# EAGLE design led_final (EAGLE 9.6.0)
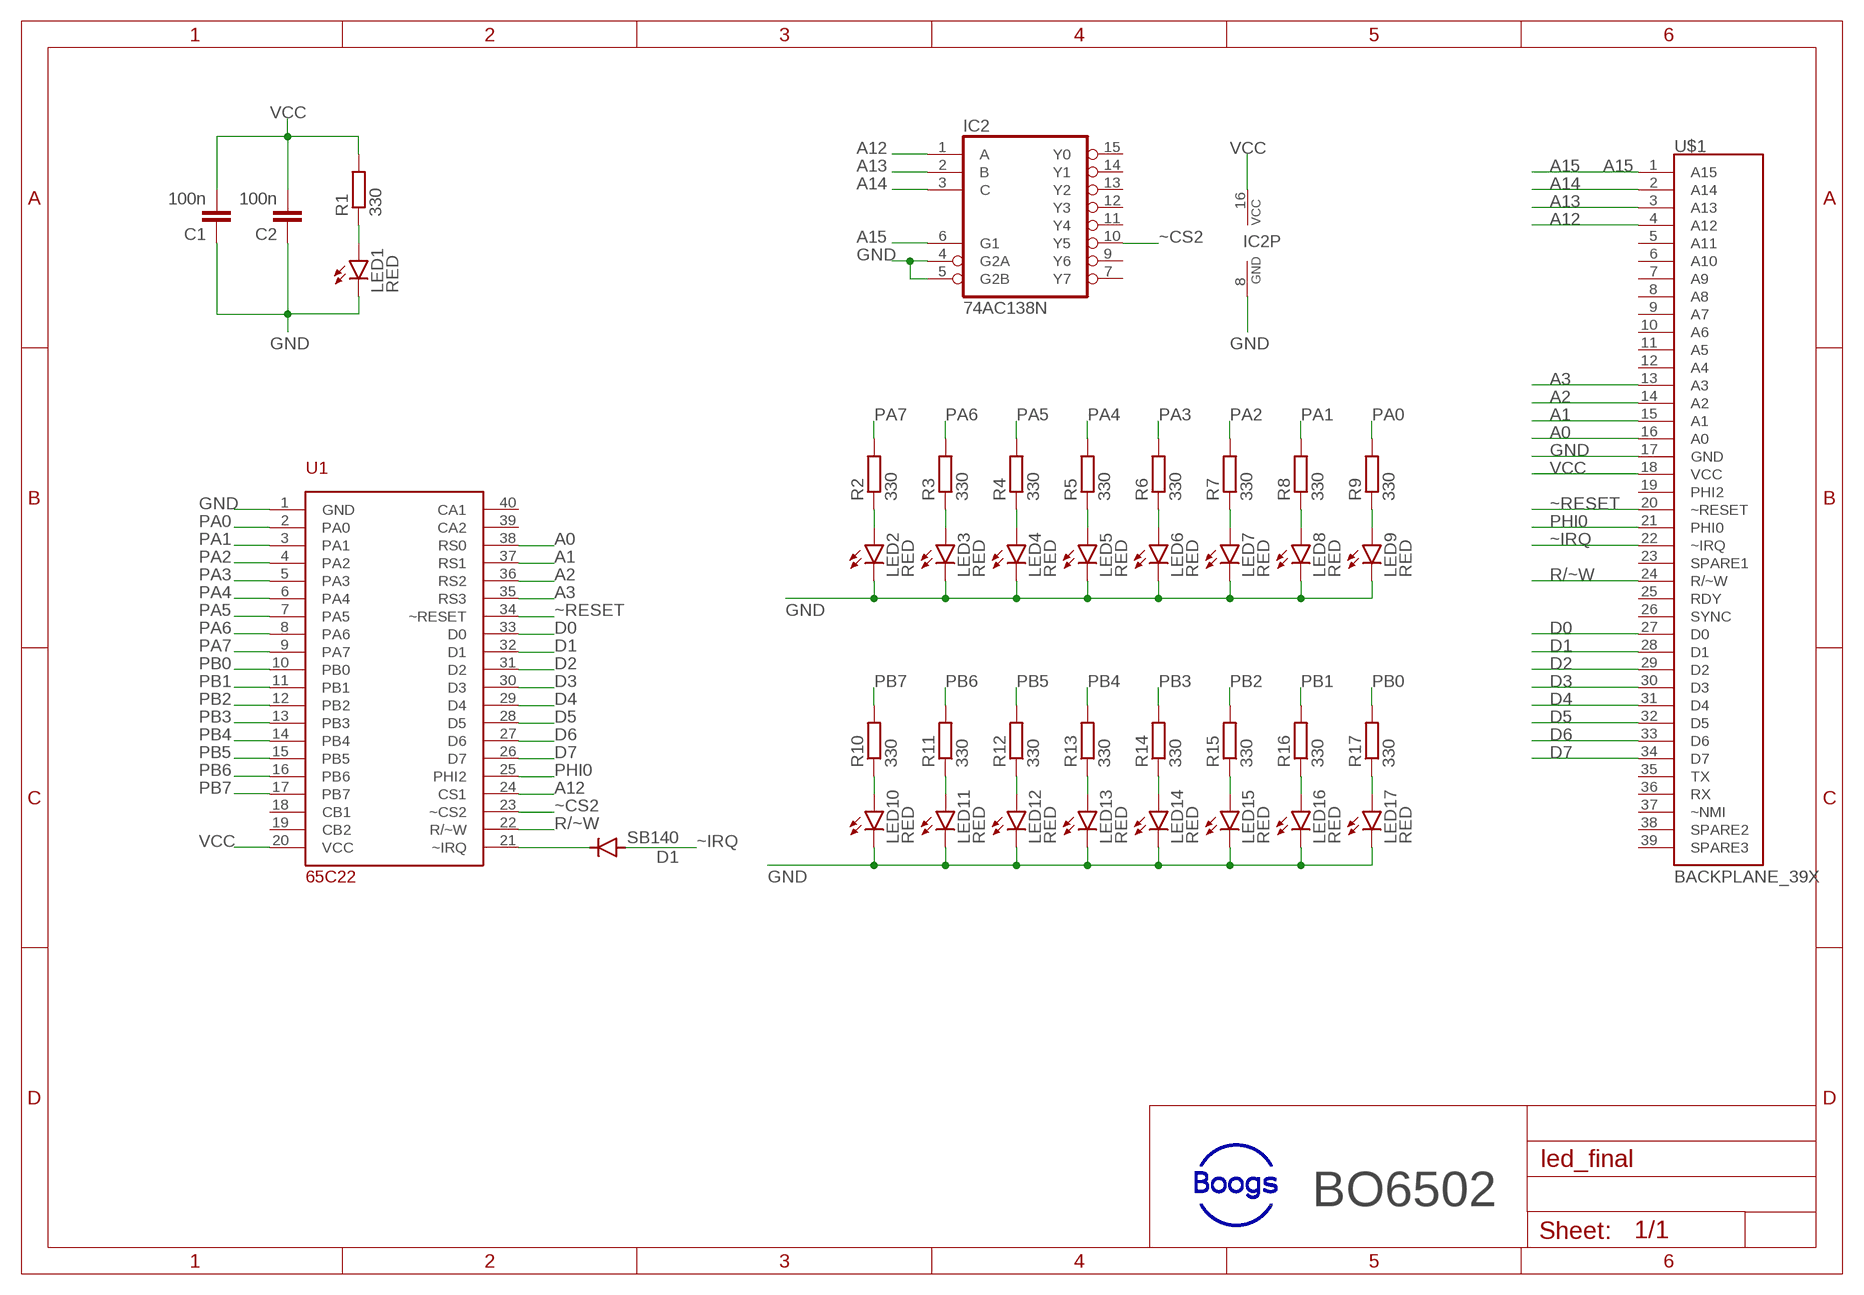
[diagram p0: schematic, sheet 1]

## Parts
C1  100n  C-EU025-025X050  [C025-025X050]
C2  100n  C-EU025-025X050  [C025-025X050]
D1  SB140  1N4004  [DO41-10]
IC2  74AC138N  [DIL16]
LED1  RED  LED5MM  [LED5MM]
LED2  RED  LED5MM  [LED5MM]
LED3  RED  LED5MM  [LED5MM]
LED4  RED  LED5MM  [LED5MM]
LED5  RED  LED5MM  [LED5MM]
LED6  RED  LED5MM  [LED5MM]
LED7  RED  LED5MM  [LED5MM]
LED8  RED  LED5MM  [LED5MM]
LED9  RED  LED5MM  [LED5MM]
LED10  RED  LED5MM  [LED5MM]
LED11  RED  LED5MM  [LED5MM]
LED12  RED  LED5MM  [LED5MM]
LED13  RED  LED5MM  [LED5MM]
LED14  RED  LED5MM  [LED5MM]
LED15  RED  LED5MM  [LED5MM]
LED16  RED  LED5MM  [LED5MM]
LED17  RED  LED5MM  [LED5MM]
R1  330  R-EU_0207/10  [0207/10]
R2  330  R-EU_0207/10  [0207/10]
R3  330  R-EU_0207/10  [0207/10]
R4  330  R-EU_0207/10  [0207/10]
R5  330  R-EU_0207/10  [0207/10]
R6  330  R-EU_0207/10  [0207/10]
R7  330  R-EU_0207/10  [0207/10]
R8  330  R-EU_0207/10  [0207/10]
R9  330  R-EU_0207/10  [0207/10]
R10  330  R-EU_0207/10  [0207/10]
R11  330  R-EU_0207/10  [0207/10]
R12  330  R-EU_0207/10  [0207/10]
R13  330  R-EU_0207/10  [0207/10]
R14  330  R-EU_0207/10  [0207/10]
R15  330  R-EU_0207/10  [0207/10]
R16  330  R-EU_0207/10  [0207/10]
R17  330  R-EU_0207/10  [0207/10]
U1  65C22  [DIL40]
U$1  BACKPLANE_39X  [BP_39X]

## Nets
A0: U1.38(RS0) U$1.16(A0)
A1: U1.37(RS1) U$1.15(A1)
A2: U1.36(RS2) U$1.14(A2)
A3: U1.35(RS3) U$1.13(A3)
A12: IC2.1(A) U1.24(CS1) U$1.4(A12)
A13: IC2.2(B) U$1.3(A13)
A14: IC2.3(C) U$1.2(A14)
A15: IC2.6(G1) U$1.1(A15)
D0: U1.33(D0) U$1.27(D0)
D1: U1.32(D1) U$1.28(D1)
D2: U1.31(D2) U$1.29(D2)
D3: U1.30(D3) U$1.30(D3)
D4: U1.29(D4) U$1.31(D4)
D5: U1.28(D5) U$1.32(D5)
D6: U1.27(D6) U$1.33(D6)
D7: U1.26(D7) U$1.34(D7)
GND: C1.1 C2.1 IC2.4(G2A) IC2.5(G2B) IC2.8(GND) LED1.K(C) LED2.K(C) LED3.K(C) LED4.K(C) LED5.K(C) LED6.K(C) LED7.K(C) LED8.K(C) LED9.K(C) LED10.K(C) LED11.K(C) LED12.K(C) LED13.K(C) LED14.K(C) LED15.K(C) LED16.K(C) LED17.K(C) U1.1(GND) U$1.17(GND)
N$1: D1.C U1.21(~IRQ)
N$3: LED2.A R2.1
N$4: LED3.A R3.1
N$6: LED1.A R1.1
N$7: LED4.A R4.1
N$8: LED5.A R5.1
N$9: LED6.A R6.1
N$10: LED7.A R7.1
N$11: LED8.A R8.1
N$12: LED9.A R9.1
N$13: LED10.A R10.1
N$14: LED11.A R11.1
N$15: LED12.A R12.1
N$16: LED13.A R13.1
N$17: LED14.A R14.1
N$18: LED15.A R15.1
N$19: LED16.A R16.1
N$20: LED17.A R17.1
PA0: R9.2 U1.2(PA0)
PA1: R8.2 U1.3(PA1)
PA2: R7.2 U1.4(PA2)
PA3: R6.2 U1.5(PA3)
PA4: R5.2 U1.6(PA4)
PA5: R4.2 U1.7(PA5)
PA6: R3.2 U1.8(PA6)
PA7: R2.2 U1.9(PA7)
PB0: R17.2 U1.10(PB0)
PB1: R16.2 U1.11(PB1)
PB2: R15.2 U1.12(PB2)
PB3: R14.2 U1.13(PB3)
PB4: R13.2 U1.14(PB4)
PB5: R12.2 U1.15(PB5)
PB6: R11.2 U1.16(PB6)
PB7: R10.2 U1.17(PB7)
PHI0: U1.25(PHI2) U$1.21(PHI0)
R/~W: U1.22(R/~W) U$1.24(R/~W)
VCC: C1.2 C2.2 IC2.16(VCC) R1.2 U1.20(VCC) U$1.18(VCC)
~CS2: IC2.10(Y5) U1.23(~CS2)
~IRQ: D1.A U$1.22(~IRQ)
~RESET: U1.34(~RESET) U$1.20(~RESET)
Unconnected: IC2.7(Y7) IC2.9(Y6) IC2.11(Y4) IC2.12(Y3) IC2.13(Y2) IC2.14(Y1) IC2.15(Y0) U1.18(CB1) U1.19(CB2) U1.39(CA2) U1.40(CA1) U$1.5(A11) U$1.6(A10) U$1.7(A9) U$1.8(A8) U$1.9(A7) U$1.10(A6) U$1.11(A5) U$1.12(A4) U$1.19(PHI2) U$1.23(SPARE1) U$1.25(RDY) U$1.26(SYNC) U$1.35(TX) U$1.36(RX) U$1.37(~NMI) U$1.38(SPARE2) U$1.39(SPARE3)

## Notes on the sheet
- BO6502

## Library data of the parts
C1 C2 = rcl:C-EU: CAPACITOR, European symbol; SPICEPREFIX: C
D1 = diode:1N4004: DIODE general purpose rectifier, 1 A
IC2 = 74xx-eu:74*138: 3-line to 8-line DECODER/DEMULTIPLEXER
LED1-LED17 = led:LED: LED OSRAM: - CHIPLED LG R971, LG N971, LY N971, LG Q971, LY Q971, LO R971, LY R971 LH N974, LH R974 LS Q976, LO Q976, LY Q976 LO Q996 - Hyper CHIPLED LW Q18S LB Q993, LB Q99A, LB R99A - SideLED LS A670, LO A670, LY A670, LG A670, LP A670 LB A673, LV A673, LT A673, LW A673 LH A674 LY A675 LS A676, LA A676, LO A676, LY A676, LW A676 LS A679, LY A679, LG A679 - Hyper Micro SIDELED® LS Y876, LA Y876, LO Y876, LY Y876 LT Y87S - SmartLED LW L88C, LW L88S LB L89C, LB L89S, LG L890 LS L89K, LO L89K, LY L89K LS L896, LA L896, LO L896, LY L896 - TOPLED LS T670, LO T670, LY T670, LG T670, LP T670 LSG T670, LSP T670, LSY T670, LOP T670, LYG T670 LG T671, LOG T671, LSG T671 LB T673, LV T673, LT T673, LW T673 LH T674 LS T676, LA T676, LO T676, LY T676, LB T676, LH T676, LSB T676, LW T676 LB T67C, LV T67C, LT T67C, LS T67K, LO T67K, LY T67K, LW E67C LS E67B, LA E67B, LO E67B, LY E67B, LB E67C, LV E67C, LT E67C LW T67C LS T679, LY T679, LG T679 LS T770, LO T770, LY T770, LG T770, LP T770 LB T773, LV T773, LT T773, LW T773 LH T774 LS E675, LA E675, LY E675, LS T675 LS T776, LA T776, LO T776, LY T776, LB T776 LHGB T686 LT T68C, LB T68C - Hyper Mini TOPLED® LB M676 - Mini TOPLED Santana® LG M470 LS M47K, LO M47K, LY M47K Source: http://www.osram.convergy.de LUXEON: - LUMILED® LXK2-PW12-R00, LXK2-PW12-S00, LXK2-PW14-U00, LXK2-PW14-V00 LXK2-PM12-R00, LXK2-PM12-S00, LXK2-PM14-U00 LXK2-PE12-Q00, LXK2-PE12-R00, LXK2-PE12-S00, LXK2-PE14-T00, LXK2-PE14-U00 LXK2-PB12-K00, LXK2-PB12-L00, LXK2-PB12-M00, LXK2-PB14-N00, LXK2-PB14-P00, LXK2-PB14-Q00 LXK2-PR12-L00, LXK2-PR12-M00, LXK2-PR14-Q00, LXK2-PR14-R00 LXK2-PD12-Q00, LXK2-PD12-R00, LXK2-PD12-S00 LXK2-PH12-R00, LXK2-PH12-S00 LXK2-PL12-P00, LXK2-PL12-Q00, LXK2-PL12-R00 Source: www.luxeon.com KINGBRIGHT: KA-3528ASYC Source: www.kingbright.com
R1-R17 = rcl:R-EU_: RESISTOR, European symbol; SPICEPREFIX: R
U1 = 65xx_family:65C22
U$1 = 65xx_family:BACKPLANE_39X; A15: A15

## Board
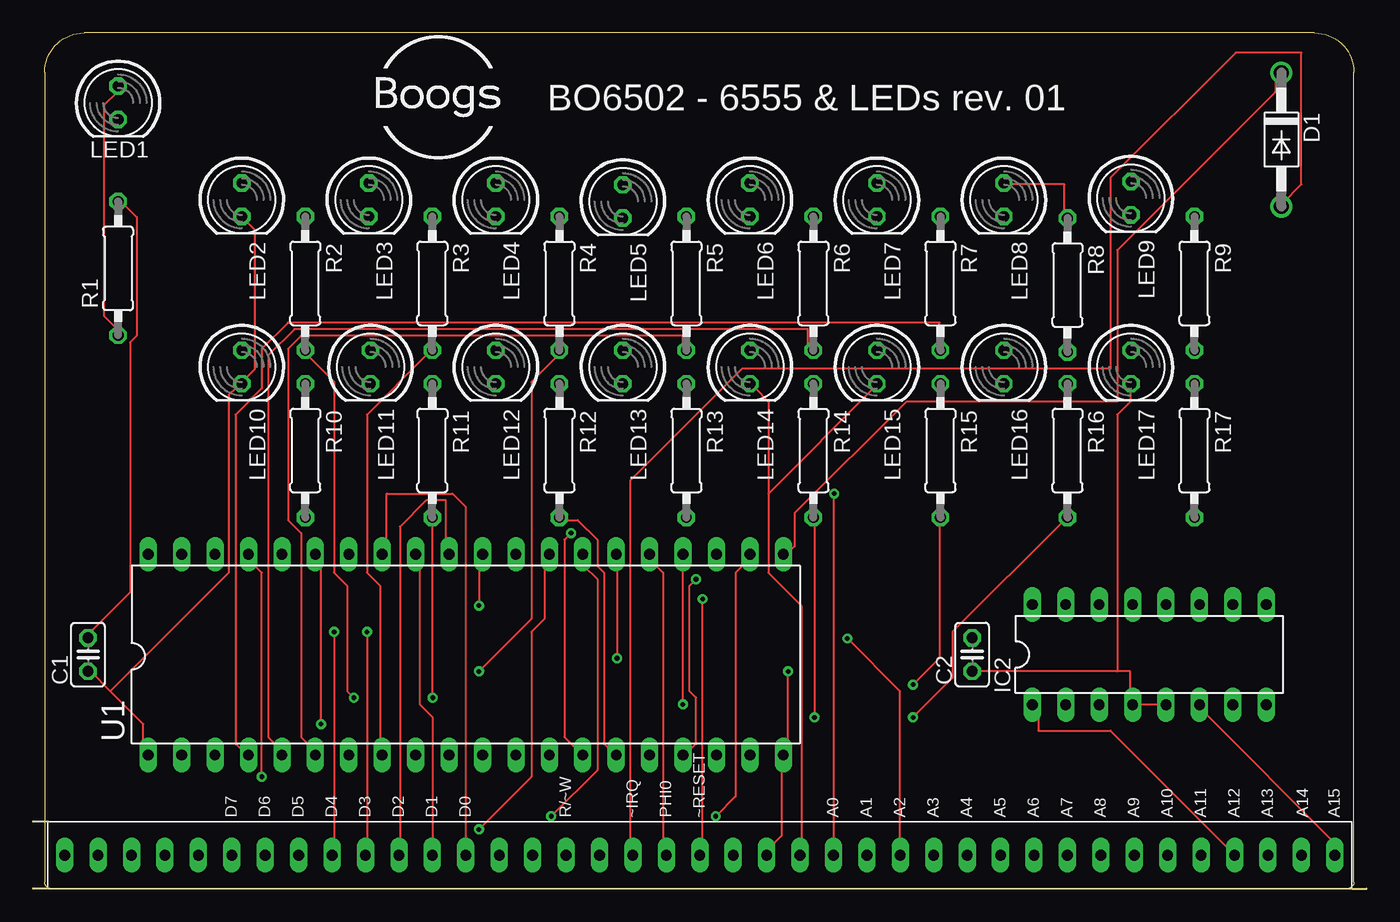
[diagram p1: board, top side]
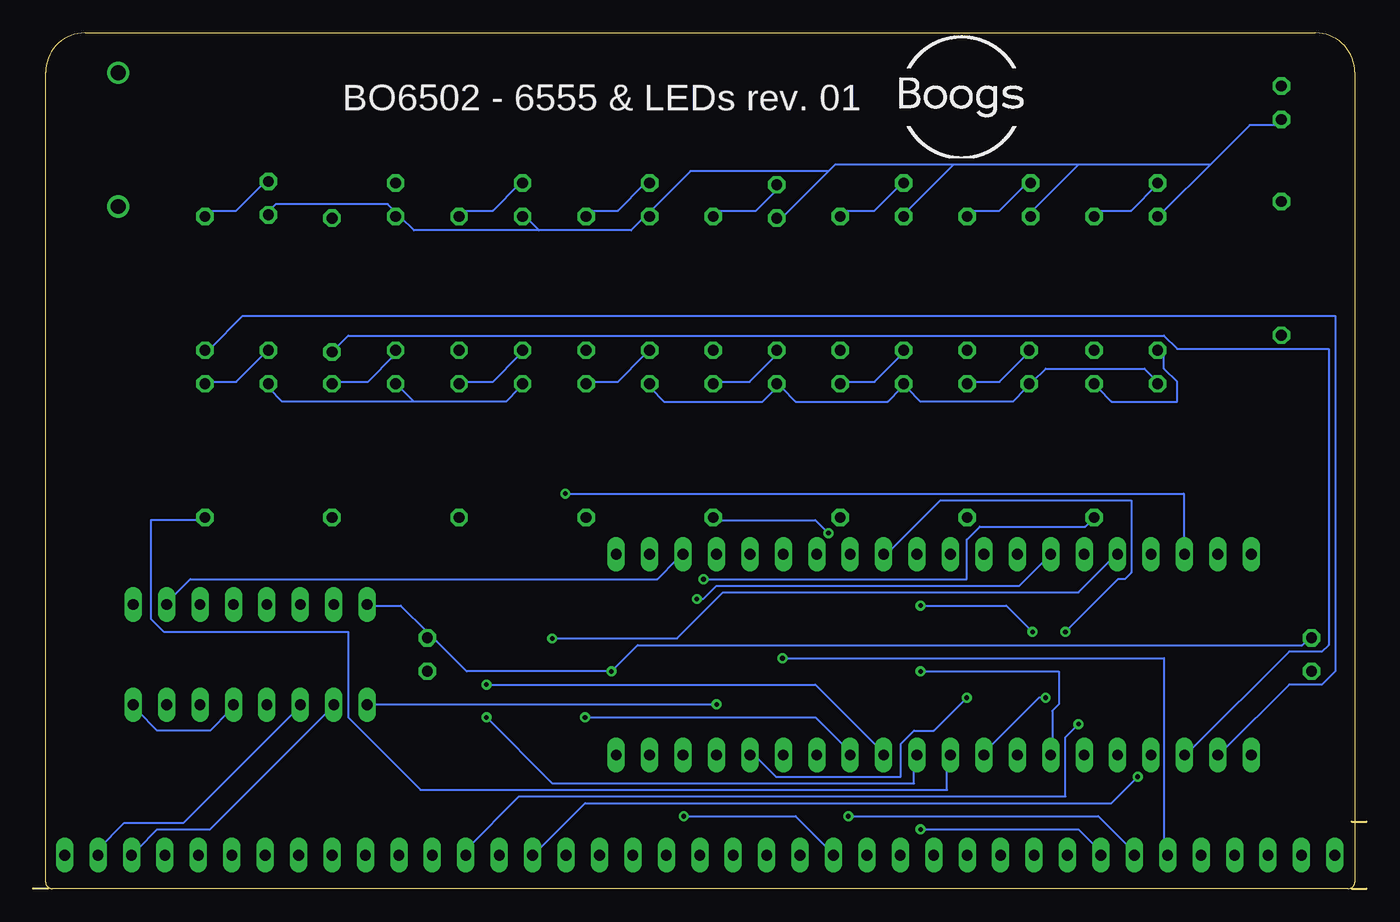
[diagram p2: board, bottom side, seen from below]

Size 101.35 x 65 mm. Coordinates in mm from the lower left corner, seen from the top.
Outline: 1.14,5.08 0,5.08
Outline: 1.14,0 0,0
Outline: 100.2,0 101.35,0
Outline: 1.39,0 99.89,0 arc90 100.39,0.5 100.39,62 arc90 97.39,65 3.89,65 arc90 0.89,62 0.89,0.5 arc90 1.39,0
Copper layers (1*16): Top 0.035mm / dielectric 1.5mm / Bottom 0.035mm
Design rules "default *": minimum track width 6mil, minimum drill 0.35mm, track to track 10mil, track to pad 10mil, pad to pad 10mil, via to via 10mil, smd to smd 6mil, copper to edge 40mil, drill to drill 6mil, minimum pad ring 10mil, minimum via ring 8mil, stop-mask expansion 4mil, vias tented up to drill 15mil, thermal gap 10mil

### Footprints (pad centres in the part's own frame; a part is rotated, then mirrored left to right if it is on the bottom)
C025-025X050 = drill 0.813 octagon: 1 -1.27,0; 2 1.27,0
DO41-10 = drill 1.118: A 5.08,0; C -5.08,0
DIL16 = drill 0.813 long: 1 -8.89,-3.81; 2 -6.35,-3.81; 3 -3.81,-3.81; 4 -1.27,-3.81; 5 1.27,-3.81; 6 3.81,-3.81; 7 6.35,-3.81; 8 8.89,-3.81; 9 8.89,3.81; 10 6.35,3.81; 11 3.81,3.81; 12 1.27,3.81; 13 -1.27,3.81; 14 -3.81,3.81; 15 -6.35,3.81; 16 -8.89,3.81
LED5MM = drill 0.813 octagon: A -1.27,0; K 1.27,0
0207/10 = drill 0.813 octagon: 1 -5.08,0; 2 5.08,0
DIL40 = drill 0.813 long: 1 -24.13,-7.62; 2 -21.59,-7.62; 3 -19.05,-7.62; 4 -16.51,-7.62; 5 -13.97,-7.62; 6 -11.43,-7.62; 7 -8.89,-7.62; 8 -6.35,-7.62; 9 -3.81,-7.62; 10 -1.27,-7.62; 11 1.27,-7.62; 12 3.81,-7.62; 13 6.35,-7.62; 14 8.89,-7.62; 15 11.43,-7.62; 16 13.97,-7.62; 17 16.51,-7.62; 18 19.05,-7.62; 19 21.59,-7.62; 20 24.13,-7.62; 21 24.13,7.62; 22 21.59,7.62; 23 19.05,7.62; 24 16.51,7.62; 25 13.97,7.62; 26 11.43,7.62; 27 8.89,7.62; 28 6.35,7.62; 29 3.81,7.62; 30 1.27,7.62; 31 -1.27,7.62; 32 -3.81,7.62; 33 -6.35,7.62; 34 -8.89,7.62; 35 -11.43,7.62; 36 -13.97,7.62; 37 -16.51,7.62; 38 -19.05,7.62; 39 -21.59,7.62; 40 -24.13,7.62
BP_39X = drill 0.813 long: 1 1.27,59.69; 2 1.27,57.15; 3 1.27,54.61; 4 1.27,52.07; 5 1.27,49.53; 6 1.27,46.99; 7 1.27,44.45; 8 1.27,41.91; 9 1.27,39.37; 10 1.27,36.83; 11 1.27,34.29; 12 1.27,31.75; 13 1.27,29.21; 14 1.27,26.67; 15 1.27,24.13; 16 1.27,21.59; 17 1.27,19.05; 18 1.27,16.51; 19 1.27,13.97; 20 1.27,11.43; 21 1.27,8.89; 22 1.27,6.35; 23 1.27,3.81; 24 1.27,1.27; 25 1.27,-1.27; 26 1.27,-3.81; 27 1.27,-6.35; 28 1.27,-8.89; 29 1.27,-11.43; 30 1.27,-13.97; 31 1.27,-16.51; 32 1.27,-19.05; 33 1.27,-21.59; 34 1.27,-24.13; 35 1.27,-26.67; 36 1.27,-29.21; 37 1.27,-31.75; 38 1.27,-34.29; 39 1.27,-36.83

### Placement (x,y rotation side)
C1  4.19,17.78 90 top
C2  71.37,17.78 90 top
D1  94.87,56.9 270 top
IC2  84.84,17.78 0 top
LED1  6.48,59.69 270 top
LED2  15.88,52.32 270 top
LED3  25.53,52.32 270 top
LED4  35.18,52.32 270 top
LED5  44.83,52.2 270 top
LED6  54.48,52.32 270 top
LED7  64.14,52.32 270 top
LED8  73.79,52.32 270 top
LED9  83.44,52.45 270 top
LED10  15.88,39.62 270 top
LED11  25.65,39.62 270 top
LED12  35.18,39.62 270 top
LED13  44.83,39.62 270 top
LED14  54.48,39.62 270 top
LED15  64.14,39.62 270 top
LED16  73.79,39.62 270 top
LED17  83.44,39.62 270 top
R1  6.48,47.12 90 top
R2  20.7,45.97 270 top
R3  30.35,45.97 270 top
R4  40.01,45.97 270 top
R5  49.66,45.97 270 top
R6  59.31,45.97 270 top
R7  68.96,45.97 270 top
R8  78.61,45.85 270 top
R9  88.27,45.97 270 top
R10  20.7,33.27 270 top
R11  30.35,33.27 270 top
R12  40.01,33.27 270 top
R13  49.66,33.27 270 top
R14  59.31,33.27 270 top
R15  68.96,33.27 270 top
R16  78.61,33.27 270 top
R17  88.27,33.27 270 top
U1  32.89,17.78 0 top
U$1  39.24,3.81 270 top

### Tracks (layer width: path | path; a pad name or v marks a point on that pad's centre or on a via)
A0  (via drill 0.35)
  Top 0.152: v60.89,30 60.89,3 U$1.16
  Bottom 0.152: v60.89,30 13.89,30 13.89,25.5 U1.38
A1  (via drill 0.35)
  Top 0.152: v17.39,8.5 17.39,24 16.39,25 U1.37
  Bottom 0.152: v17.39,8.5 19.39,6.5 59.39,6.5 62.89,3 U$1.15
A2  (via drill 0.35)
  Top 0.152: v61.89,19 65.89,15 65.89,3 U$1.14
  Bottom 0.152: v61.89,19 52.39,19 48.89,22.5 21.89,22.5 19.39,25 U1.36
A3  (via drill 0.35)
  Top 0.152: v21.89,12.5 21.89,25 U1.35
  Bottom 0.152: v21.89,12.5 22.89,11.5 22.89,7 64.39,7 68.39,3 U$1.13
A12  (via drill 0.35)
  Top 0.152: v49.39,14 49.39,25 U1.24 | U$1.4 90.89,3 81.89,12 76.39,12 76.39,13.5 IC2.1
  Bottom 0.152: v49.39,14 75.89,14 IC2.1
A13
  Bottom 0.152: IC2.2 78.89,13.5 87.89,4.5 91.89,4.5 93.39,3 U$1.3
A14
  Bottom 0.152: IC2.3 81.39,13.5 89.89,5 94.39,5 96.39,3 U$1.2
A15
  Top 0.152: IC2.6 88.89,13.5 98.89,3.5 98.89,3 U$1.1
D0
  Top 0.152: U$1.27 32.89,3 32.89,29 31.89,30 26.89,30 26.89,25.5 U1.33
D1
  Top 0.152: U$1.28 30.39,3 30.39,13 29.39,14 29.39,25 U1.32
D2
  Top 0.152: U$1.29 27.89,3 27.89,27.5 29.89,29.5 31.39,29.5 31.39,25.5 U1.31
D3  (via drill 0.35)
  Top 0.152: v25.39,19.5 25.39,3 U$1.30 | v33.89,21.5 33.89,25 U1.30
  Bottom 0.152: v25.39,19.5 27.39,21.5 v33.89,21.5
D4  (via drill 0.35)
  Top 0.152: v22.89,19.5 22.89,3 U$1.31
  Bottom 0.152: v22.89,19.5 18.89,23.5 18.39,23.5 17.89,24 17.89,29.5 32.39,29.5 36.39,25.5 U1.29
D5  (via drill 0.35)
  Top 0.152: v33.89,4.5 37.89,8.5 37.89,19.5 38.89,20.5 38.89,25 U1.28
  Bottom 0.152: v33.89,4.5 21.89,4.5 20.39,3 U$1.32
D6  (via drill 0.35)
  Top 0.152: v39.39,5.5 42.89,9 42.89,23.5 41.89,24.5 41.89,25 U1.27
  Bottom 0.152: v39.39,5.5 20.39,5.5 17.89,3 U$1.33
D7  (via drill 0.35)
  Top 0.152: v44.39,17.5 44.39,25 U1.26
  Bottom 0.152: v44.39,17.5 15.39,17.5 15.39,3 U$1.34
GND
  Top 0.152: 5.89,15 8.39,12.5 8.39,10.5 U1.1 | 5.89,15 4.39,16.5 C1.1 | 5.89,15 14.89,24 14.89,37.5 15.39,38 LED10.K 15.89,38.5 16.89,39.5 16.89,50 15.89,51 LED2.K | 82.39,16.5 83.39,16.5 83.39,14 IC2.4 83.89,14 85.89,14 IC2.5 | 82.39,16.5 71.39,16.5 C2.1 | 55.89,30 55.89,37 54.89,38 LED14.K | 55.89,30 55.89,24 58.39,21.5 58.39,3 U$1.17 | 55.89,30 63.89,38 LED15.K | 82.39,16.5 82.39,36 83.39,37 83.39,38 LED17.K
  Bottom 0.152: 11.89,55 8.89,58 6.89,58 LED1.K | 11.89,55 15.39,51.5 LED2.K | 21.89,55 25.39,51.5 LED3.K | 11.89,55 21.89,55 | 31.39,55 34.89,51.5 LED4.K | 21.89,55 31.39,55 | 40.89,54.5 40.39,55 31.39,55 | 40.89,54.5 44.39,51 LED5.K | 40.89,54.5 51.39,54.5 54.39,51.5 LED6.K 54.89,51 55.89,50 62.89,50 | 62.89,50 63.89,51 LED7.K | 62.89,50 72.39,50 73.39,51 LED8.K 73.89,51.5 74.39,52 82.89,52 83.39,51.5 LED9.K | LED10.K 15.89,38.5 16.89,39.5 24.39,39.5 25.39,38.5 LED11.K 25.89,38 26.89,37 33.89,37 34.89,38 LED12.K 35.39,38 36.39,37 43.39,37 44.39,38 LED13.K 44.89,38 45.89,37 53.39,37 54.39,38 LED14.K | IC2.8 93.39,13.5 91.89,12 87.89,12 86.39,13.5 IC2.5 | 72.39,37 73.39,38 LED16.K | 72.39,37 65.39,37 64.39,38 LED15.K | 72.39,37 82.39,37 83.39,38 LED17.K
N$1
  Top 0.152: U1.21 57.39,25.5 57.89,26 57.89,28.5 66.39,37 82.39,37 82.39,48.5 94.39,60.5 94.39,61.5 D1.C
N$3
  Bottom 0.152: LED2.A 15.89,53.5 17.89,51.5 20.39,51.5 R2.1
N$4
  Bottom 0.152: LED3.A 25.89,53.5 27.89,51.5 29.89,51.5 R3.1
N$6
  Top 0.152: R1.1 6.39,42.5 5.39,43.5 5.39,59.5 6.39,60.5 LED1.A
N$7
  Bottom 0.152: LED4.A 35.39,53.5 37.39,51.5 39.89,51.5 R4.1
N$8
  Bottom 0.152: LED5.A 44.89,53 46.39,51.5 49.39,51.5 R5.1
N$9
  Bottom 0.152: LED6.A 54.89,53.5 56.89,51.5 58.89,51.5 R6.1
N$10
  Bottom 0.152: LED7.A 64.39,53.5 66.39,51.5 68.89,51.5 R7.1
N$11
  Top 0.152: LED8.A 73.89,53.5 78.39,53.5 78.39,51 R8.1
N$12
  Bottom 0.152: LED9.A 83.89,53.5 85.89,51.5 87.89,51.5 R9.1
N$13
  Bottom 0.152: LED10.A 15.39,40.5 15.39,39.5 14.39,38.5 14.39,37 19.39,37 20.39,38 R10.1
N$14
  Bottom 0.152: LED11.A 25.89,40.5 27.89,38.5 29.89,38.5 R11.1
N$15
  Bottom 0.152: LED12.A 35.39,40.5 37.39,38.5 39.89,38.5 R12.1
N$16
  Bottom 0.152: LED13.A 44.89,40.5 46.89,38.5 49.39,38.5 R13.1
N$17
  Bottom 0.152: LED14.A 54.89,40.5 56.89,38.5 58.89,38.5 R14.1
N$18
  Bottom 0.152: LED15.A 64.39,40.5 66.39,38.5 68.89,38.5 R15.1
N$19
  Bottom 0.152: LED16.A 73.89,40.5 75.89,38.5 78.39,38.5 R16.1
N$20
  Bottom 0.152: LED17.A 83.89,40.5 85.89,38.5 87.89,38.5 R17.1
PA0
  Bottom 0.152: U1.2 10.89,10.5 5.89,15.5 3.39,15.5 2.39,16.5 2.39,43.5 85.39,43.5 87.89,41 R9.2
PA1
  Bottom 0.152: U1.3 13.39,10.5 5.89,18 3.39,18 2.89,18.5 2.89,41 14.39,41 15.39,42 77.39,42 78.39,41 R8.2
PA2
  Top 0.152: U1.4 15.89,10.5 15.39,11 15.39,36 17.39,38 17.39,41 19.39,43 68.89,43 68.89,41 R7.2
PA3
  Top 0.152: U1.5 18.89,10.5 17.89,11.5 17.89,40.5 19.89,42.5 58.89,42.5 58.89,41 R6.2
PA4
  Top 0.152: U1.6 21.39,10.5 20.39,11.5 20.39,27 19.39,28 19.39,41 20.39,42 49.39,42 49.39,41 R5.2
PA5  (via drill 0.35)
  Top 0.152: v33.89,16.5 37.89,20.5 37.89,38.5 39.89,40.5 R4.2
  Bottom 0.152: v33.89,16.5 23.39,16.5 23.39,14 23.89,13.5 23.89,10.5 U1.7
PA6
  Top 0.152: U1.8 26.39,10.5 26.39,23 25.39,24 25.39,36 29.89,40.5 R3.2
PA7  (via drill 0.35)
  Top 0.152: v24.39,14.5 23.89,15 23.89,23 22.89,24 22.89,38.5 20.89,40.5 R2.2
  Bottom 0.152: v24.39,14.5 24.89,14.5 28.89,10.5 U1.9
PB0
  Bottom 0.152: U1.10 31.89,10 31.89,7.5 71.89,7.5 77.39,13 77.39,19.5 91.39,19.5 92.39,20.5 92.39,28 88.39,28 R17.2
PB1  (via drill 0.35)
  Top 0.152: v66.89,13 69.89,16 69.89,19.5 78.39,28 R16.2
  Bottom 0.152: v66.89,13 61.89,8 34.39,8 34.39,10 U1.11
PB2  (via drill 0.35)
  Top 0.152: v66.89,15.5 68.89,17.5 68.89,28 R15.2
  Bottom 0.152: v66.89,15.5 41.89,15.5 36.89,10.5 U1.12
PB3  (via drill 0.35)
  Top 0.152: v59.39,13 59.39,28 R14.2
  Bottom 0.152: v59.39,13 41.89,13 39.39,10.5 U1.13
PB4  (via drill 0.35)
  Top 0.152: v40.89,27 40.39,26.5 40.39,11.5 41.39,10.5 U1.14
  Bottom 0.152: v40.89,27 41.89,28 49.39,28 R13.2
PB5
  Top 0.152: U1.15 43.89,10.5 43.39,11 43.39,24 42.89,24.5 42.89,26.5 41.39,28 40.39,28 R12.2
PB6  (via drill 0.35)
  Top 0.152: v30.39,14.5 30.39,28 R11.2
  Bottom 0.152: v30.39,14.5 32.89,12 34.39,12 35.39,11 35.39,8.5 44.89,8.5 46.39,10 U1.16
PB7  (via drill 0.35)
  Top 0.152: v50.39,23.5 49.89,23 49.89,15 50.39,14.5 50.39,11 49.89,10.5 U1.17
  Bottom 0.152: v50.39,23.5 30.39,23.5 30.39,26.5 29.39,27.5 21.39,27.5 20.89,28 R10.2
PHI0
  Top 0.152: U$1.21 47.89,3 47.89,24 46.89,25 U1.25
R/~W  (via drill 0.35)
  Top 0.152: v51.89,5.5 53.39,7 53.39,24 54.39,25 U1.22
  Bottom 0.152: v51.89,5.5 43.39,5.5 40.89,3 U$1.24
VCC  (via drill 0.35)
  Top 0.152: C1.2 4.39,19.5 7.39,22.5 7.39,41.5 7.89,42 7.89,51 6.89,52 R1.2 | U$1.18 55.89,3 56.89,4 56.89,10 U1.20 57.39,10.5 v57.39,16.5
  Bottom 0.152: IC2.16 75.89,21.5 73.39,21.5 71.39,19.5 C2.2 70.89,19 68.39,16.5 v57.39,16.5 55.39,18.5 4.89,18.5 4.39,19 C1.2
~CS2
  Bottom 0.152: U1.23 52.39,25 53.89,23.5 89.39,23.5 90.89,22 IC2.10
~IRQ
  Top 0.152: U$1.22 45.39,3 45.39,31 53.89,39.5 81.89,39.5 81.89,54 91.39,63.5 96.39,63.5 96.39,53.5 94.89,52 D1.A
~RESET  (via drill 0.35)
  Top 0.152: v50.89,22 50.89,3 U$1.20
  Bottom 0.152: v50.89,22 50.39,22 49.39,23 26.39,23 24.39,25 U1.34

### Text on the board
tNames: BO6502 - 6555 & LEDs rev. 01 | D7 | D6 | D5 | D4 | D3 | D2 | D1 | D0 | R/~W | ~IRQ | PHI0 | ~RESET | A0 | A1 | A2 | A3 | A4 | A5 | A6 | A7 | A8 | A9 | A10 | A11 | A12 | A13 | A14 | A15
bNames: BO6502 - 6555 & LEDs rev. 01